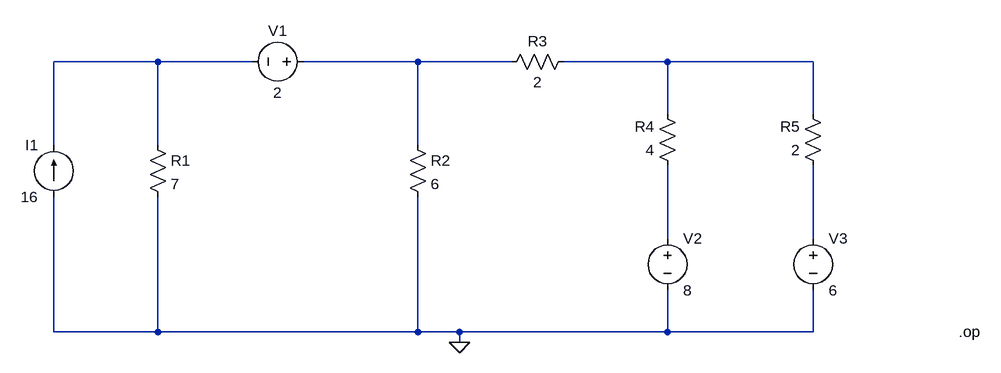
[diagram p0: schematic circ_3_prova_pc.asc]
circ_3_prova_pc.asc, the LTspice schematic file:
Version 4
SHEET 1 1156 680
WIRE -112 208 -272 208
WIRE 32 208 -112 208
WIRE 288 208 112 208
WIRE 432 208 288 208
WIRE 672 208 512 208
WIRE 896 208 672 208
WIRE 672 288 672 208
WIRE 896 288 896 208
WIRE -272 336 -272 208
WIRE -112 336 -112 208
WIRE 288 336 288 208
WIRE 672 480 672 368
WIRE 896 480 896 368
WIRE -272 624 -272 416
WIRE -112 624 -112 416
WIRE -112 624 -272 624
WIRE 288 624 288 416
WIRE 288 624 -112 624
WIRE 352 624 288 624
WIRE 672 624 672 560
WIRE 672 624 352 624
WIRE 896 624 896 560
WIRE 896 624 672 624
WIRE 352 640 352 624
FLAG 352 640 0
SYMBOL res -128 320 R0
SYMATTR InstName R1
SYMATTR Value 7
SYMBOL res 272 320 R0
SYMATTR InstName R2
SYMATTR Value 6
SYMBOL res 528 192 R90
WINDOW 0 0 56 VBottom 2
WINDOW 3 32 56 VTop 2
SYMATTR InstName R3
SYMATTR Value 2
SYMBOL res 688 384 R180
WINDOW 0 36 76 Left 2
WINDOW 3 36 40 Left 2
SYMATTR InstName R4
SYMATTR Value 4
SYMBOL res 912 384 R180
WINDOW 0 36 76 Left 2
WINDOW 3 36 40 Left 2
SYMATTR InstName R5
SYMATTR Value 2
SYMBOL current -272 416 R180
WINDOW 0 24 80 Left 2
WINDOW 3 24 0 Left 2
SYMATTR InstName I1
SYMATTR Value 16
SYMBOL voltage 128 208 R90
WINDOW 0 -32 56 VBottom 2
WINDOW 3 32 56 VTop 2
SYMATTR InstName V1
SYMATTR Value 2
SYMBOL voltage 672 464 R0
SYMATTR InstName V2
SYMATTR Value 8
SYMBOL voltage 896 464 R0
SYMATTR InstName V3
SYMATTR Value 6
TEXT 1120 624 Left 2 !.op

The netlist it stands for:
* circ_3_prova_pc.asc
R1 N001 0 7
R2 N002 0 6
R3 N003 N002 2
R4 N004 N003 4
R5 N005 N003 2
I1 0 N001 16
V1 N002 N001 2
V2 N004 0 8
V3 N005 0 6
.op
.backanno
.end